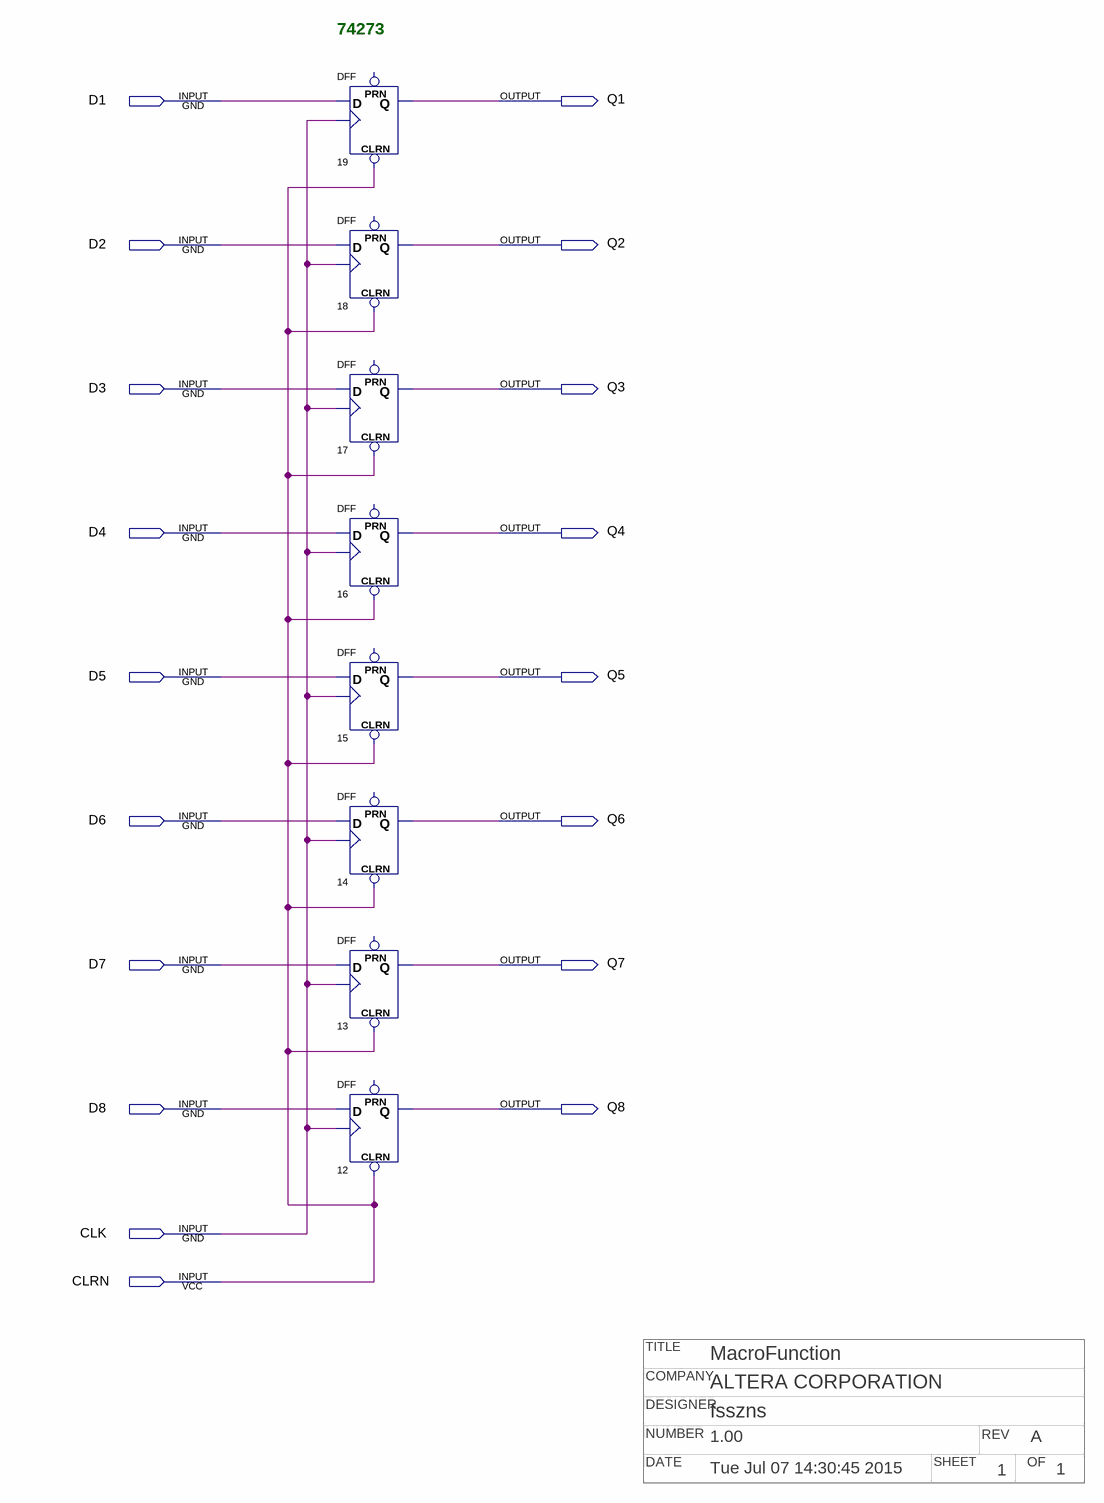
[diagram p0: schematic sheet]
// Quartus schematic a74273.bdf as structural Verilog: 8 symbols, 18 pins
// Title block: TITLE: MacroFunction; COMPANY: ALTERA CORPORATION; DESIGNER: fsszns; NUMBER: 1.00; REV: A; DATE: Tue Jul 07 14:30:45 2015; SHEET: 1; OF: 1
module a74273 (
  input  D1,
  input  D2,
  input  D3,
  input  D4,
  input  D5,
  input  D6,
  input  D7,
  input  D8,
  input  CLK,
  input  CLRN,
  output Q1,
  output Q2,
  output Q3,
  output Q4,
  output Q5,
  output Q6,
  output Q7,
  output Q8
);

  DFF u_19 (.CLRN(CLRN), .CLK(CLK), .D(D1), .Q(Q1));  // open: PRN
  DFF u_18 (.CLRN(CLRN), .CLK(CLK), .D(D2), .Q(Q2));  // open: PRN
  DFF u_17 (.CLRN(CLRN), .CLK(CLK), .D(D3), .Q(Q3));  // open: PRN
  DFF u_16 (.CLRN(CLRN), .CLK(CLK), .D(D4), .Q(Q4));  // open: PRN
  DFF u_15 (.CLRN(CLRN), .CLK(CLK), .D(D5), .Q(Q5));  // open: PRN
  DFF u_14 (.CLRN(CLRN), .CLK(CLK), .D(D6), .Q(Q6));  // open: PRN
  DFF u_13 (.CLRN(CLRN), .CLK(CLK), .D(D7), .Q(Q7));  // open: PRN
  DFF u_12 (.CLRN(CLRN), .CLK(CLK), .D(D8), .Q(Q8));  // open: PRN

  // Notes on the sheet:
  //   74273
endmodule
